# EAGLE schematic FreddyMerger (EAGLE 7.7.0)
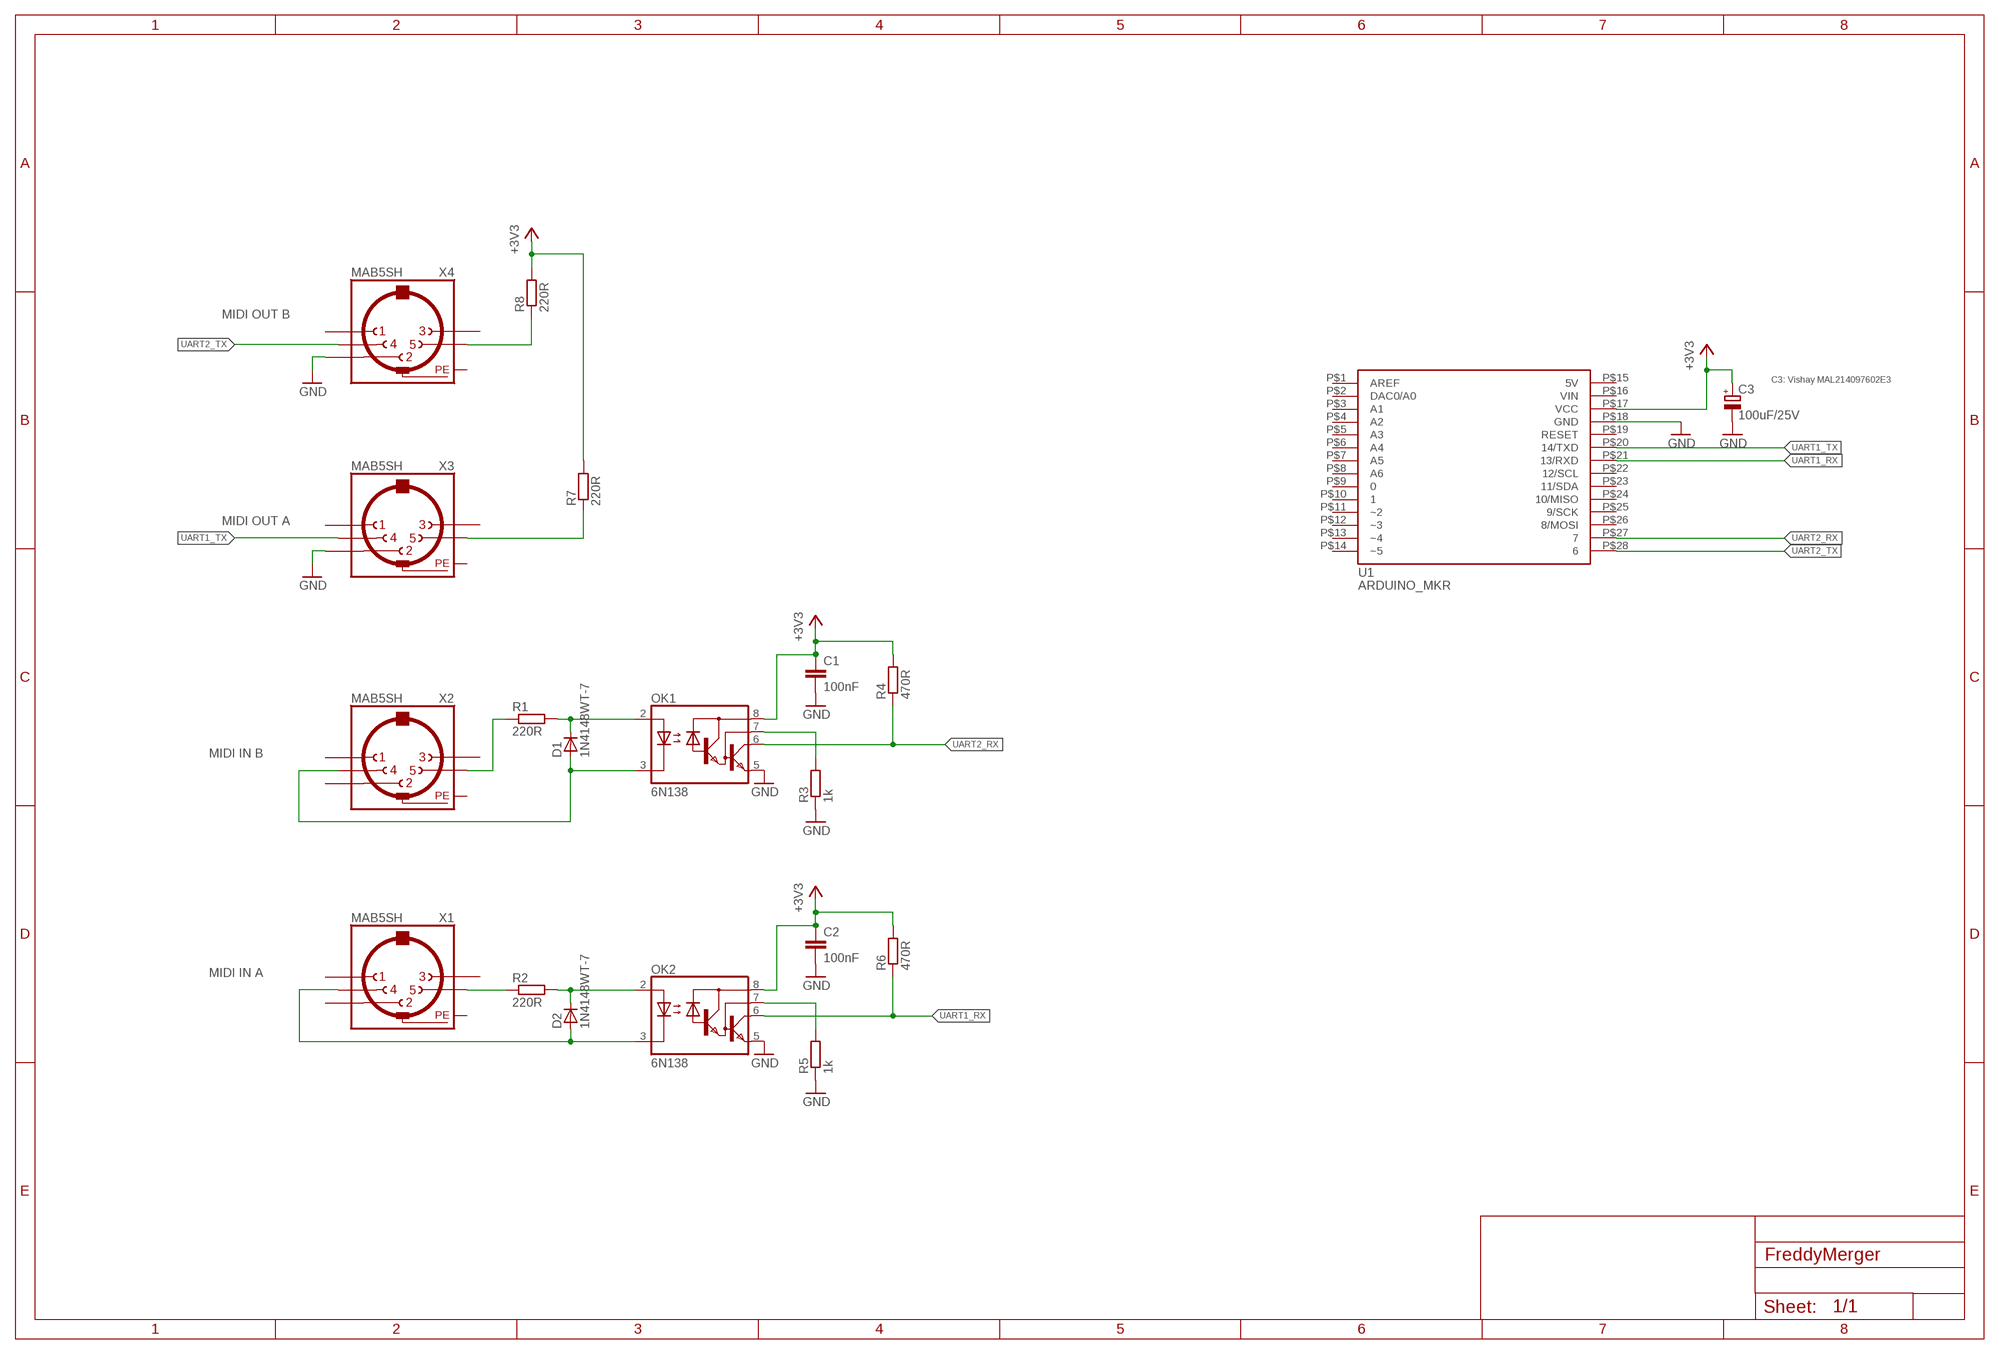
[diagram p0: schematic, sheet 1]

## Parts
C1  100nF  C-EUC0805  [C0805]
C2  100nF  C-EUC0805  [C0805]
C3  100uF/25V  CPOL-EU140CLH-0810  [140CLH-0810]
D1  1N4148WT-7  D-SOD123  [SOD123]
D2  1N4148WT-7  D-SOD123  [SOD123]
OK1  6N138  [DIL08]
OK2  6N138  [DIL08]
R1  220R  R-EU_R0805  [R0805]
R2  220R  R-EU_R0805  [R0805]
R3  1k  R-EU_R0805  [R0805]
R4  470R  R-EU_R0805  [R0805]
R5  1k  R-EU_R0805  [R0805]
R6  470R  R-EU_R0805  [R0805]
R7  220R  R-EU_R0805  [R0805]
R8  220R  R-EU_R0805  [R0805]
U1  ARDUINO_MKR  [ARDUINO_MKR]
X1  MAB5SH  [MAB5SH]
X2  MAB5SH  [MAB5SH]
X3  MAB5SH  [MAB5SH]
X4  MAB5SH  [MAB5SH]

## Nets
+3V3: C1.1 C2.1 C3.+ OK1.8(VCC) OK2.8(VCC) R4.2 R6.2 R7.2 R8.2 U1.P$17(VCC)
GND: C1.2 C2.2 C3.- OK1.5(GND) OK2.5(GND) R3.1 R5.1 U1.P$18(GND) X3.2 X4.2
N$1: R1.1 X2.5
N$2: R2.1 X1.5
N$3: D1.1(C) OK1.2(A) R1.2
N$4: D2.1(C) OK2.2(A) R2.2
N$5: D1.2(A) OK1.3(C) X2.4
N$6: D2.2(A) OK2.3(C) X1.4
N$7: OK2.7(VB) R5.2
N$8: OK1.7(VB) R3.2
N$10: R8.1 X4.5
N$11: R7.1 X3.5
UART1_RX: OK2.6(VO) R6.1 U1.P$21(13/RXD)
UART1_TX: U1.P$20(14/TXD) X3.4
UART2_RX: OK1.6(VO) R4.1 U1.P$27
UART2_TX: U1.P$28 X4.4
Unconnected: U1.P$1(AREF) U1.P$2(DAC0/A0) U1.P$3(A1) U1.P$4(A2) U1.P$5(A3) U1.P$6(A4) U1.P$7(A5) U1.P$8(A6) U1.P$9 U1.P$10 U1.P$11(~2) U1.P$12(~3) U1.P$13(~4) U1.P$14(~5) U1.P$15(5V) U1.P$16(VIN) U1.P$19(RESET) U1.P$22(12/SCL) U1.P$23(11/SDA) U1.P$24(10/MISO) U1.P$25(9/SCK) U1.P$26(8/MOSI) X1.1 X1.2 X1.3 X2.1 X2.2 X2.3 X3.1 X3.3 X4.1 X4.3

## Notes on the sheet
- MIDI OUT B
- C3: Vishay MAL214097602E3
- MIDI OUT A
- MIDI IN B
- MIDI IN A

## Power pins joined to a net without a drawn wire
PE: X1.PE X1.PE@(PE) X2.PE X2.PE@(PE) X3.PE X3.PE@(PE) X4.PE X4.PE@(PE)

## Library data of the parts
C1 C2 = rcl:C-EU: CAPACITOR, European symbol
C3 = rcl:CPOL-EU: POLARIZED CAPACITOR, European symbol
D1 D2 = semicon-smd-ipc:D-: DIODE unfilled
OK1 OK2 = optocoupler:6N138: MOTOROLA OPTO COUPLER; MF: VISHAY/TELEFUNKEN; MPN: 6N138; OC_FARNELL: 9860150; OC_NEWARK: 35K5294
R1-R8 = rcl:R-EU_: RESISTOR, European symbol
U1 = frederic:ARDUINO_MKR
X1-X4 = con-hirschmann:MAB5SH: Female CONNECTOR 5 pins 90 deg. with shield, horizontal (DIN 41524); OC_FARNELL: 809883; OC_NEWARK: unknown